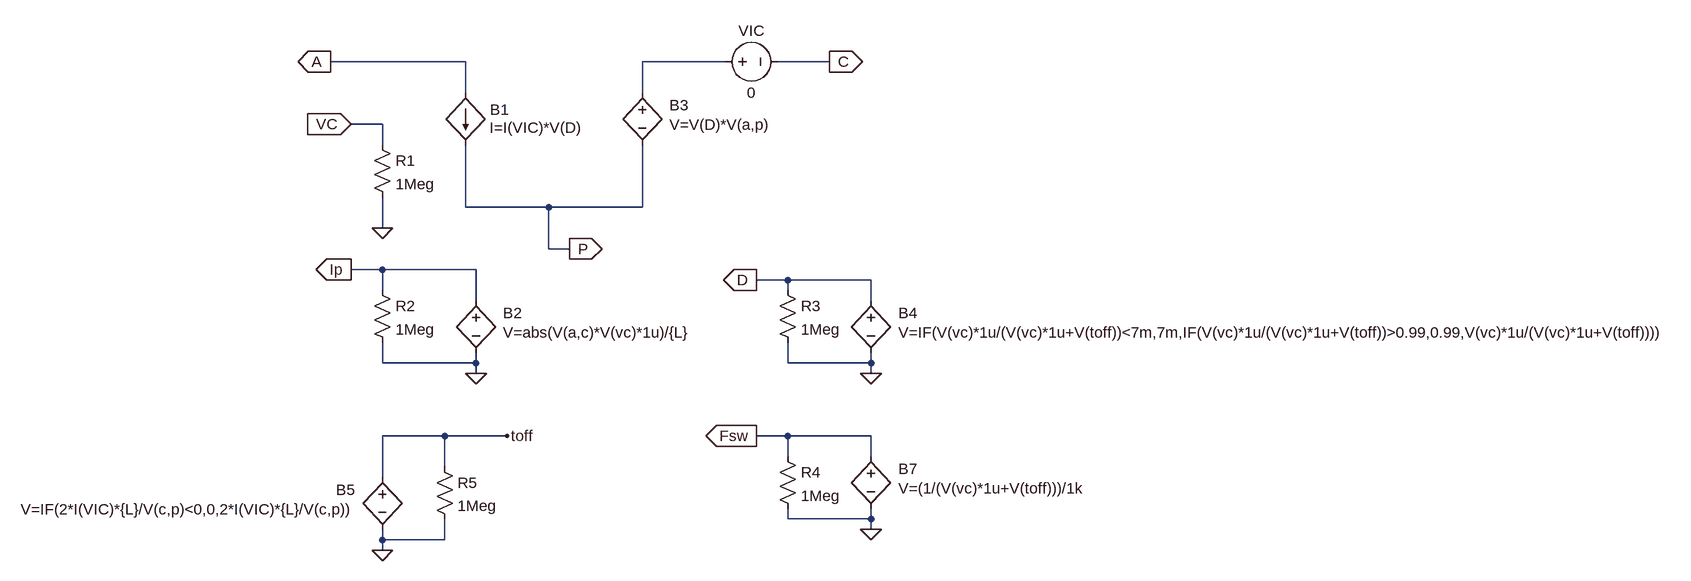
[diagram p0: schematic PWMBCMVM.asc]
PWMBCMVM.asc, the LTspice schematic file:
Version 4
SHEET 1 2112 820
WIRE 64 48 -144 48
WIRE 464 48 336 48
WIRE 624 48 544 48
WIRE 64 96 64 48
WIRE 336 96 336 48
WIRE -64 144 -112 144
WIRE -64 176 -64 144
WIRE 64 272 64 176
WIRE 192 272 64 272
WIRE 336 272 336 176
WIRE 336 272 192 272
WIRE -64 304 -64 256
WIRE 192 336 192 272
WIRE 224 336 192 336
WIRE -64 368 -112 368
WIRE 80 368 -64 368
WIRE 560 384 512 384
WIRE 688 384 560 384
WIRE -64 400 -64 368
WIRE 560 400 560 384
WIRE 80 416 80 368
WIRE 688 416 688 384
WIRE -64 512 -64 480
WIRE 80 512 80 496
WIRE 80 512 -64 512
WIRE 560 512 560 480
WIRE 688 512 688 496
WIRE 688 512 560 512
WIRE 80 528 80 512
WIRE 688 528 688 512
WIRE 32 624 -64 624
WIRE 128 624 32 624
WIRE 560 624 512 624
WIRE 688 624 560 624
WIRE 560 656 560 624
WIRE 688 656 688 624
WIRE 32 672 32 624
WIRE -64 688 -64 624
WIRE 560 752 560 736
WIRE 688 752 688 736
WIRE 688 752 560 752
WIRE 688 768 688 752
WIRE -64 784 -64 768
WIRE 32 784 32 752
WIRE 32 784 -64 784
WIRE -64 800 -64 784
FLAG 80 528 0
FLAG -144 48 A
IOPIN -144 48 Out
FLAG 624 48 C
IOPIN 624 48 Out
FLAG 224 336 P
IOPIN 224 336 Out
FLAG -112 368 Ip
IOPIN -112 368 Out
FLAG 688 528 0
FLAG 512 384 D
IOPIN 512 384 Out
FLAG -64 800 0
FLAG 128 624 toff
FLAG 512 624 Fsw
IOPIN 512 624 Out
FLAG 688 768 0
FLAG -64 304 0
FLAG -112 144 VC
IOPIN -112 144 In
SYMBOL bi 64 96 R0
WINDOW 0 38 26 Left 2
WINDOW 3 37 53 Left 2
SYMATTR InstName B1
SYMATTR Value I=I(VIC)*V(D)
SYMBOL bv 80 400 R0
WINDOW 0 42 35 Left 2
WINDOW 3 42 65 Left 2
SYMATTR InstName B2
SYMATTR Value V=abs(V(a,c)*V(vc)*1u)/{L}
SYMBOL voltage 448 48 R270
WINDOW 0 32 56 VTop 2
WINDOW 3 -32 56 VBottom 2
WINDOW 123 0 0 Left 0
WINDOW 39 0 0 Left 0
SYMATTR InstName VIC
SYMATTR Value 0
SYMBOL bv 688 400 R0
WINDOW 0 42 35 Left 2
WINDOW 3 42 65 Left 2
SYMATTR InstName B4
SYMATTR Value V=IF(V(vc)*1u/(V(vc)*1u+V(toff))<7m,7m,IF(V(vc)*1u/(V(vc)*1u+V(toff))>0.99,0.99,V(vc)*1u/(V(vc)*1u+V(toff))))
SYMBOL bv -64 672 M0
WINDOW 0 42 35 Left 2
WINDOW 3 42 65 Left 2
SYMATTR InstName B5
SYMATTR Value V=IF(2*I(VIC)*{L}/V(c,p)<0,0,2*I(VIC)*{L}/V(c,p))
SYMBOL bv 688 640 R0
WINDOW 0 42 35 Left 2
WINDOW 3 42 65 Left 2
SYMATTR InstName B7
SYMATTR Value V=(1/(V(vc)*1u+V(toff)))/1k
SYMBOL bv 336 80 R0
WINDOW 0 42 35 Left 2
WINDOW 3 42 65 Left 2
SYMATTR InstName B3
SYMATTR Value V=V(D)*V(a,p)
SYMBOL res -80 160 R0
SYMATTR InstName R1
SYMATTR Value 1Meg
SYMBOL res -80 384 R0
SYMATTR InstName R2
SYMATTR Value 1Meg
SYMBOL res 544 384 R0
SYMATTR InstName R3
SYMATTR Value 1Meg
SYMBOL res 544 640 R0
SYMATTR InstName R4
SYMATTR Value 1Meg
SYMBOL res 16 656 R0
SYMATTR InstName R5
SYMATTR Value 1Meg

The netlist it stands for:
* PWMBCMVM.asc
B1 A P I=I(VIC)*V(D)
B2 Ip 0 V=abs(V(a,c)*V(vc)*1u)/{L}
VIC N001 C 0
B4 D 0 V=IF(V(vc)*1u/(V(vc)*1u+V(toff))<7m,7m,IF(V(vc)*1u/(V(vc)*1u+V(toff))>0.99,0.99,V(vc)*1u/(V(vc)*1u+V(toff))))
B5 toff 0 V=IF(2*I(VIC)*{L}/V(c,p)<0,0,2*I(VIC)*{L}/V(c,p))
B7 Fsw 0 V=(1/(V(vc)*1u+V(toff)))/1k
B3 N001 P V=V(D)*V(a,p)
R1 VC 0 1Meg
R2 Ip 0 1Meg
R3 D 0 1Meg
R4 Fsw 0 1Meg
R5 toff 0 1Meg
.backanno
.end